# EAGLE design RaspberryMesh (EAGLE 6.3)
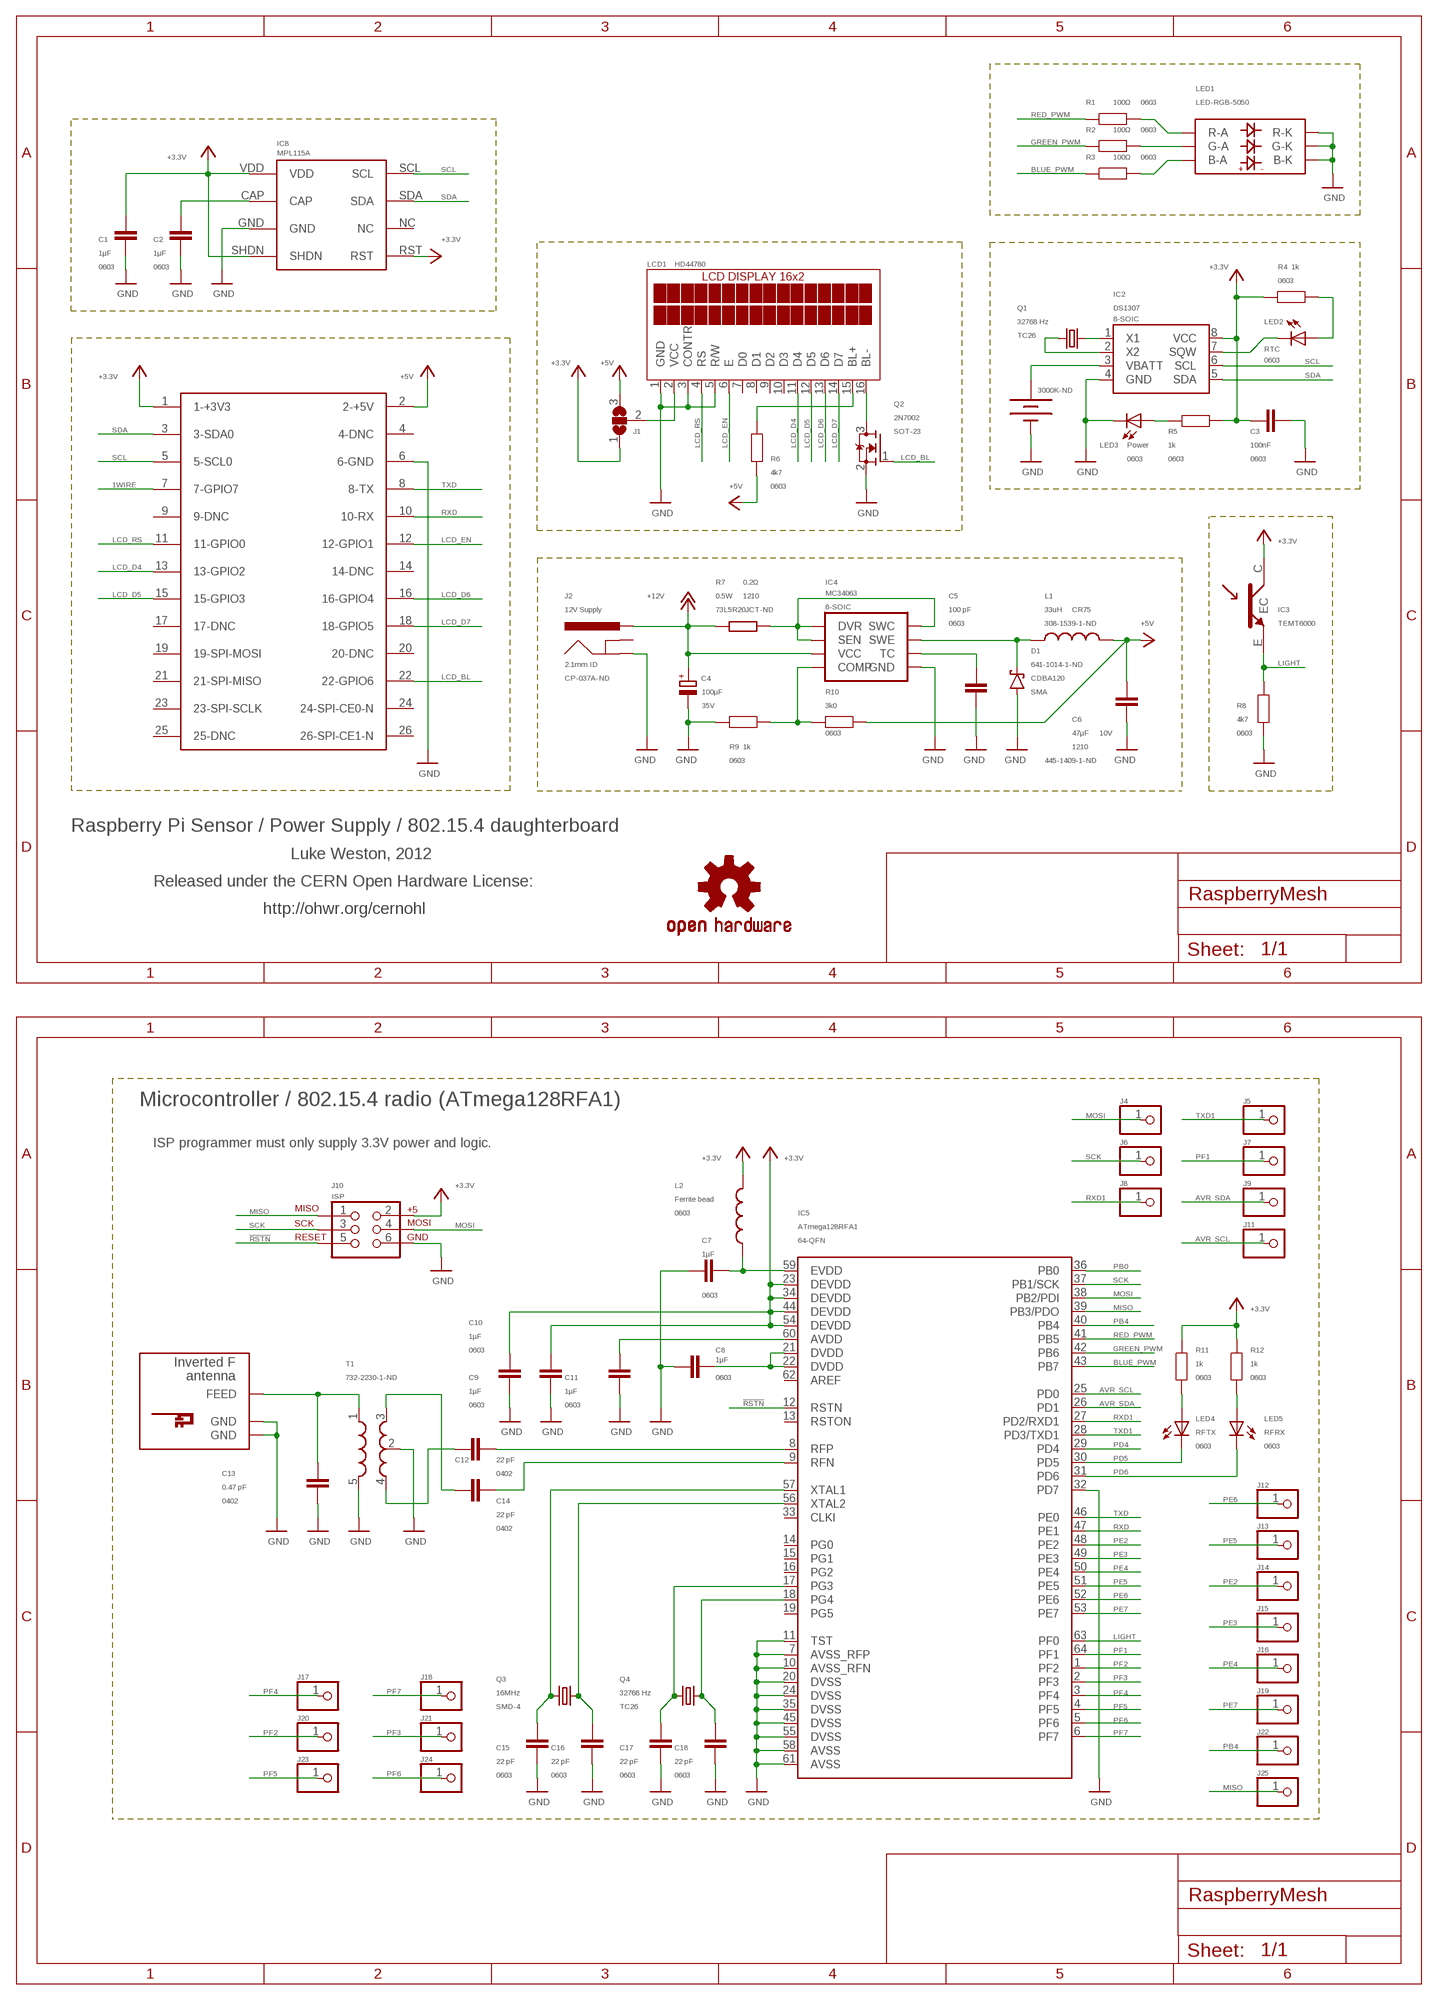
[diagram p0: schematic, sheet 1]

## Parts
A1  INVERTED_F_ANTENNA+2  [DN007+2]
B1  3000K-ND  BATTERY12MM  [BATTCON_12MM]
C1  1µF  CAP0603  [0603]
C2  1µF  CAP0603  [0603]
C3  100nF  CAP0603  [0603]
C4  100µF  CPOL-EUE2.5-6  [E2,5-6]
C5  100 pF  CAP0603  [0603]
C6  47µF  C-EUC1210  [C1210]
C7  1µF  CAP0603  [0603]
C8  1µF  CAP0603  [0603]
C9  1µF  CAP0603  [0603]
C10  1µF  CAP0603  [0603]
C11  1µF  CAP0603  [0603]
C12  22 pF  CAP0402  [C0402]
C13  0.47 pF  CAP0402  [C0402]
C14  22 pF  CAP0402  [C0402]
C15  22 pF  CAP0603  [0603]
C16  22 pF  CAP0603  [0603]
C17  22 pF  CAP0603  [0603]
C18  22 pF  CAP0603  [0603]
D1  CDBA120  SCHOTTKY  [SMA]
IC1  MPL115A  [MPL115A]
IC2  DS1307  DS1307SO8  [SO08]
IC3  TEMT6000  TEMT6000SMT  [TEMT6000]
IC4  MC34063  MC34063SMD  [SO08@1]
IC5  ATmega128RFA1  ATMEGA128RFA1  [QFN-64]
J1  SJ2W  [SJ_2]
J2  12V Supply  POWER_JACKSLT  [POWER_JACK_SLOT]
J3  RASPBERRY-PI  [RASPBERRY-PI]
J4  PINHD-1X1  [1X01]
J5  PINHD-1X1  [1X01]
J6  PINHD-1X1  [1X01]
J7  PINHD-1X1  [1X01]
J8  PINHD-1X1  [1X01]
J9  PINHD-1X1  [1X01]
J10  ISP  AVR_SPI_PRG_6NS  [2X3-NS]
J11  PINHD-1X1  [1X01]
J12  PINHD-1X1  [1X01]
J13  PINHD-1X1  [1X01]
J14  PINHD-1X1  [1X01]
J15  PINHD-1X1  [1X01]
J16  PINHD-1X1  [1X01]
J17  PINHD-1X1  [1X01]
J18  PINHD-1X1  [1X01]
J19  PINHD-1X1  [1X01]
J20  PINHD-1X1  [1X01]
J21  PINHD-1X1  [1X01]
J22  PINHD-1X1  [1X01]
J23  PINHD-1X1  [1X01]
J24  PINHD-1X1  [1X01]
J25  PINHD-1X1  [1X01]
L1  33uH  INDUCTORCR75  [CR75]
L2  Ferrite bead  INDUCTOR0603  [0603]
LCD1  HD44780  LCD_16X2_NEWLCD_16X2  [LCD_16X2_REAR]
LED1  LED-RGB-5050  LED-RGB-50505050  [LED-RGB-5050]
LED2  RTC  LED0603  [LED-0603]
LED3  Power  LED0603  [LED-0603]
LED4  RFTX  LED0603  [LED-0603]
LED5  RFRX  LED0603  [LED-0603]
Q1  32768 Hz  CRYSTAL32-SMD  [CRYSTAL-32KHZ-SMD]
Q2  2N7002  MOSFET-NREFLOW  [SOT23]
Q3  16MHz  CRYSTAL5X3  [CRYSTAL-SMD-5X3]
Q4  32768 Hz  CRYSTAL32-SMD  [CRYSTAL-32KHZ-SMD]
R1  100Ω  RESISTOR0603  [0603]
R2  100Ω  RESISTOR0603  [0603]
R3  100Ω  RESISTOR0603  [0603]
R4  1k  RESISTOR0603  [0603]
R5  1k  RESISTOR0603  [0603]
R6  4k7  RESISTOR0603  [0603]
R7  0.2Ω  R-EU_R1210  [R1210]
R8  4k7  RESISTOR0603  [0603]
R9  1k  RESISTOR0603  [0603]
R10  3k0  RESISTOR0603  [0603]
R11  1k  RESISTOR0603  [0603]
R12  1k  RESISTOR0603  [0603]
SY1  OSHW-LOGOS  [OSHW-LOGO-S]
T1  732-2230-1-ND  BALUN0805  [BALUN]

## Nets
1WIRE: J3.7(7-GPIO7)
!RSTN: IC5.12(RSTN) J10.5
+3V3: C1.2 C3.1 C9.1 C10.1 IC1.RST IC1.SHDN IC1.VDD IC2.8(VCC) IC3.C IC5.23(DEVDD) IC5.34(DEVDD) IC5.44(DEVDD) IC5.54(DEVDD) J1.1 J3.1(1-+3V3) J10.2 L2.2 R4.2 R5.2 R11.2 R12.2 ; supply symbol labelled +3.3V
+5V: C6.1 J1.3 J3.2(2-+5V) L1.P$2 R6.2 R10.1
+12V: C4.+ IC4.6(VCC) J2.PWR R7.1
AVR_SCL: IC5.25(PD0) J11.1
AVR_SDA: IC5.26(PD1) J9.1
BLUE_PWM: IC5.43(PB7) R3.2
GND: A1.GND A1.GND@1(GND) B1.GND(-) C1.1 C2.1 C3.2 C4.- C5.2 C6.2 C7.2 C8.2 C9.2 C10.2 C11.2 C13.2 C15.1 C16.1 C17.1 C18.1 D1.A IC1.GND IC2.4(GND) IC4.4(GND) IC5.7(AVSS_RFP) IC5.10(AVSS_RFN) IC5.11(TST) IC5.20(DVSS) IC5.24(DVSS) IC5.32(PD7) IC5.35(DVSS) IC5.45(DVSS) IC5.55(DVSS) IC5.58(AVSS) IC5.61(AVSS) J2.GND J3.6(6-GND) J10.6 LCD1.1(GND) LCD1.3(CONTR) LCD1.5(R/W) LED1.BK(B-K) LED1.GK(G-K) LED1.RK(R-K) LED3.C Q2.2(S) R8.1 R9.2 T1.2(GND) T1.5(GND)
GREEN_PWM: IC5.42(PB6) R2.2
LCD_BL: J3.22(22-GPIO6) Q2.1(G)
LCD_D4: J3.13(13-GPIO2) LCD1.11(D4)
LCD_D5: J3.15(15-GPIO3) LCD1.12(D5)
LCD_D6: J3.16(16-GPIO4) LCD1.13(D6)
LCD_D7: J3.18(18-GPIO5) LCD1.14(D7)
LCD_EN: J3.12(12-GPIO1) LCD1.6(E)
LCD_RS: J3.11(11-GPIO0) LCD1.4(RS)
LIGHT: IC3.E IC5.63(PF0) R8.2
MISO: IC5.39(PB3/PDO) J10.1 J25.1
MOSI: IC5.38(PB2/PDI) J4.1 J10.4
N$1: J1.2 LCD1.2(VCC)
N$2: IC4.1(SWC) IC4.7(SEN) IC4.8(DVR) R7.2
N$3: LCD1.15(BL+) R6.1
N$4: IC2.7(SQW) LED2.C
N$5: C5.1 IC4.3(TC)
N$6: LCD1.16(BL-) Q2.3(D)
N$7: IC4.5(COMP) R9.1 R10.2
N$8: LED3.A R5.1
N$10: C2.2 IC1.CAP
N$12: IC2.2(X2) Q1.X1
N$13: IC2.1(X1) Q1.X2
N$14: LED2.A R4.1
N$16: B1.PWR@1(+) IC2.3(VBATT)
N$18: C14.2 T1.3(OUT1)
N$25: C12.2 T1.4(OUT2)
N$30: C16.2 IC5.56(XTAL2) Q3.3
N$31: C15.2 IC5.57(XTAL1) Q3.1
N$32: C17.2 IC5.17(PG3) Q4.X1
N$34: C18.2 IC5.18(PG4) Q4.X2
N$35: C8.1 IC5.21(DVDD) IC5.22(DVDD)
N$36: C11.1 IC5.60(AVDD)
N$38: A1.FEED C13.1 T1.1(IN)
N$39: C7.1 IC5.59(EVDD) L2.1
N$40: C12.1 IC5.8(RFP)
N$41: C14.1 IC5.9(RFN)
N$43: LED4.A R11.1
N$44: LED5.A R12.1
N$45: D1.K IC4.2(SWE) L1.P$1
N$47: LED1.RA(R-A) R1.1
N$48: LED1.GA(G-A) R2.1
N$49: LED1.BA(B-A) R3.1
PB0: IC5.36(PB0)
PB4: IC5.40(PB4) J22.1
PD4: IC5.29(PD4)
PD5: IC5.30(PD5) LED4.C
PD6: IC5.31(PD6) LED5.C
PE2: IC5.48(PE2) J14.1
PE3: IC5.49(PE3) J15.1
PE4: IC5.50(PE4) J16.1
PE5: IC5.51(PE5) J13.1
PE6: IC5.52(PE6) J12.1
PE7: IC5.53(PE7) J19.1
PF1: IC5.64(PF1) J7.1
PF2: IC5.1(PF2) J20.1
PF3: IC5.2(PF3) J21.1
PF4: IC5.3(PF4) J17.1
PF5: IC5.4(PF5) J23.1
PF6: IC5.5(PF6) J24.1
PF7: IC5.6(PF7) J18.1
RED_PWM: IC5.41(PB5) R1.2
RXD: IC5.47(PE1) J3.10(10-RX)
RXD1: IC5.27(PD2/RXD1) J8.1
SCK: IC5.37(PB1/SCK) J6.1 J10.3
SCL: IC1.SCL IC2.6(SCL) J3.5(5-SCL0)
SDA: IC1.SDA IC2.5(SDA) J3.3(3-SDA0)
TXD: IC5.46(PE0) J3.8(8-TX)
TXD1: IC5.28(PD3/TXD1) J5.1
Unconnected: IC1.NC IC5.13(RSTON) IC5.14(PG0) IC5.15(PG1) IC5.16(PG2) IC5.19(PG5) IC5.33(CLKI) IC5.62(AREF) J2.SW(GNDBREAK) J3.4(4-DNC) J3.9(9-DNC) J3.14(14-DNC) J3.17(17-DNC) J3.19(19-SPI-MOSI) J3.20(20-DNC) J3.21(21-SPI-MISO) J3.23(23-SPI-SCLK) J3.24(24-SPI-CE0-N) J3.25(25-DNC) J3.26(26-SPI-CE1-N) LCD1.7(D0) LCD1.8(D1) LCD1.9(D2) LCD1.10(D3)

## Notes on the sheet
- Raspberry Pi Sensor / Power Supply / 802.15.4 daughterboard
- Luke Weston, 2012
- Released under the CERN Open Hardware License:
- http://ohwr.org/cernohl
- Microcontroller / 802.15.4 radio (ATmega128RFA1)
- ISP programmer must only supply 3.3V power and logic.

## Library data of the parts
A1 = antenna:INVERTED_F_ANTENNA: 2.4GHz Inverted F Antenna Based on TI Design Note DN007
B1 = SparkFun:BATTERY: Battery Holders Various common sizes : AA, AAA, 20mm coin cell and 12mm coin cell.
C1-C3 C5 C7-C11 C15-C18 = freetronics-master-v1:CAP: Capacitor Standard 0603 ceramic capacitor, and 0.1" leaded capacitor.; PACKAGE: 0603
C4 = rcl:CPOL-EU: POLARIZED CAPACITOR, European symbol; VOLTAGE: 35V
C6 = rcl:C-EU: CAPACITOR, European symbol; PACKAGE: 1210; SKU: 445-1409-1-ND; VOLTAGE: 10V
C12-C14 = freetronics-master-v1:CAP: Capacitor Standard 0603 ceramic capacitor, and 0.1" leaded capacitor.; PACKAGE: 0402
D1 = freetronics-luke:SCHOTTKY; PACKAGE: SMA; SKU: 641-1014-1-ND
IC1 = SparkFun:MPL115A; NAME2: IC8; VALUE2: MPL115A
IC2 = SparkFun:DS1307; PACKAGE: 8-SOIC
IC3 = freetronics-jon:TEMT6000
IC4 = SparkFun:MC34063; PACKAGE: 8-SOIC
IC5 = SparkFun:ATMEGA128RFA1; PACKAGE: 64-QFN
J1 = jumper:SJ2W: SMD solder JUMPER
J2 = SparkFun:POWER_JACK: Power Jack This is the standard 5.5mm barrel jack for power. The PTH is the most common, proven, reliable, footprint. All others are experimental. The Slot footprint only works if the mill layer is transmitted to the PCB fab house so be warned. Spark Fun Electronics SKU : PRT-00119. Mating wall wart : TOL-00298 (and others); DIAMETER: 2.1mm ID; SKU: CP-037A-ND
J3 = RaspberryPi:RASPBERRY-PI: Raspberry Pi Board <http://www.raspberrypi.org/> Jacques Lagnel V1.0 (beta) 2012 Board dimension: Forum 3D model <http://www.raspberrypi.org/forum/general-discussion/mechanical-profile-3d-models?value=3d%20model&type=1&include=1&search=1&ret=all> The GPIO Connector (P1): http://elinux.org/RPi_Low-level_peripherals
J4-J9 J11-J25 = pinhead:PINHD-1X1: PIN HEADER
J10 = SparkFun:AVR_SPI_PRG_6: AVR ISP 6 Pin This is the reduced ISP connector for AVR programming. Common on Arduino. This footprint will take up less PCB space and can be used with a 10-pin to 6-pin adapter such as SKU: BOB-08508
L1 = SparkFun:INDUCTOR: Inductors Basic Inductor/Choke - 0603 and 1206. Footprints are not proven and vary greatly between part numbers.; PACKAGE: CR75; SKU: 308-1539-1-ND
L2 = freetronics-master-v1:INDUCTOR: Inductors Basic Inductor/Choke - 0603 and 1206. Footprints are not proven and vary greatly between part numbers.; PACKAGE: 0603
LCD1 = freetronics-master-v1:LCD_16X2_NEW: Tuxgraphics LCD display 16x2 characters reflective, without background light Source: tuxgr_12x2_r2.pdf
LED1 = freetronics-master-v1:LED-RGB-5050
LED2-LED5 = freetronics-master-v1:LED: LEDs Standard schematic elements and footprints for 5mm, 3mm, 1206, and 0603 sized LEDs. 5mm - Spark Fun Electronics SKU : COM-00529 (and others); PACKAGE: 0603
Q1 Q4 = SparkFun:CRYSTAL: Crystals Various standard crystals. Proven footprints. Spark Fun Electronics SKU : COM-00534; PACKAGE: TC26
Q2 = adafruit:MOSFET-N: N-Channel Mosfet 2N7002E - 60V 260mA SOT23 [Digikey: 2N7002ET1GOSTR-ND] - REEL BSH103 - 30V 850mA SOT23 [Digikey: 568-5013-1-ND]; PACKAGE: SOT-23
Q3 = SparkFun:CRYSTAL: Crystals Various standard crystals. Proven footprints. Spark Fun Electronics SKU : COM-00534; PACKAGE: SMD-4
R1-R6 R8-R12 = freetronics-master-v1:RESISTOR: Resistor Basic schematic elements and footprints for 0603, 1206, and PTH 1/10th watt (small) resistors.; PACKAGE: 0603
R7 = rcl:R-EU_: RESISTOR, European symbol; PACKAGE: 1210; POWER: 0.5W; SKU: 73L5R20JCT-ND
SY1 = SparkFun:OSHW-LOGO: Open Source Hardware Logo This logo indicates the piece of hardware it is found on incorporates a OSHW license and/or adheres to the definition of open source hardware found here: http://freedomdefined.org/OSHW
T1 = SparkFun:BALUN

## Board
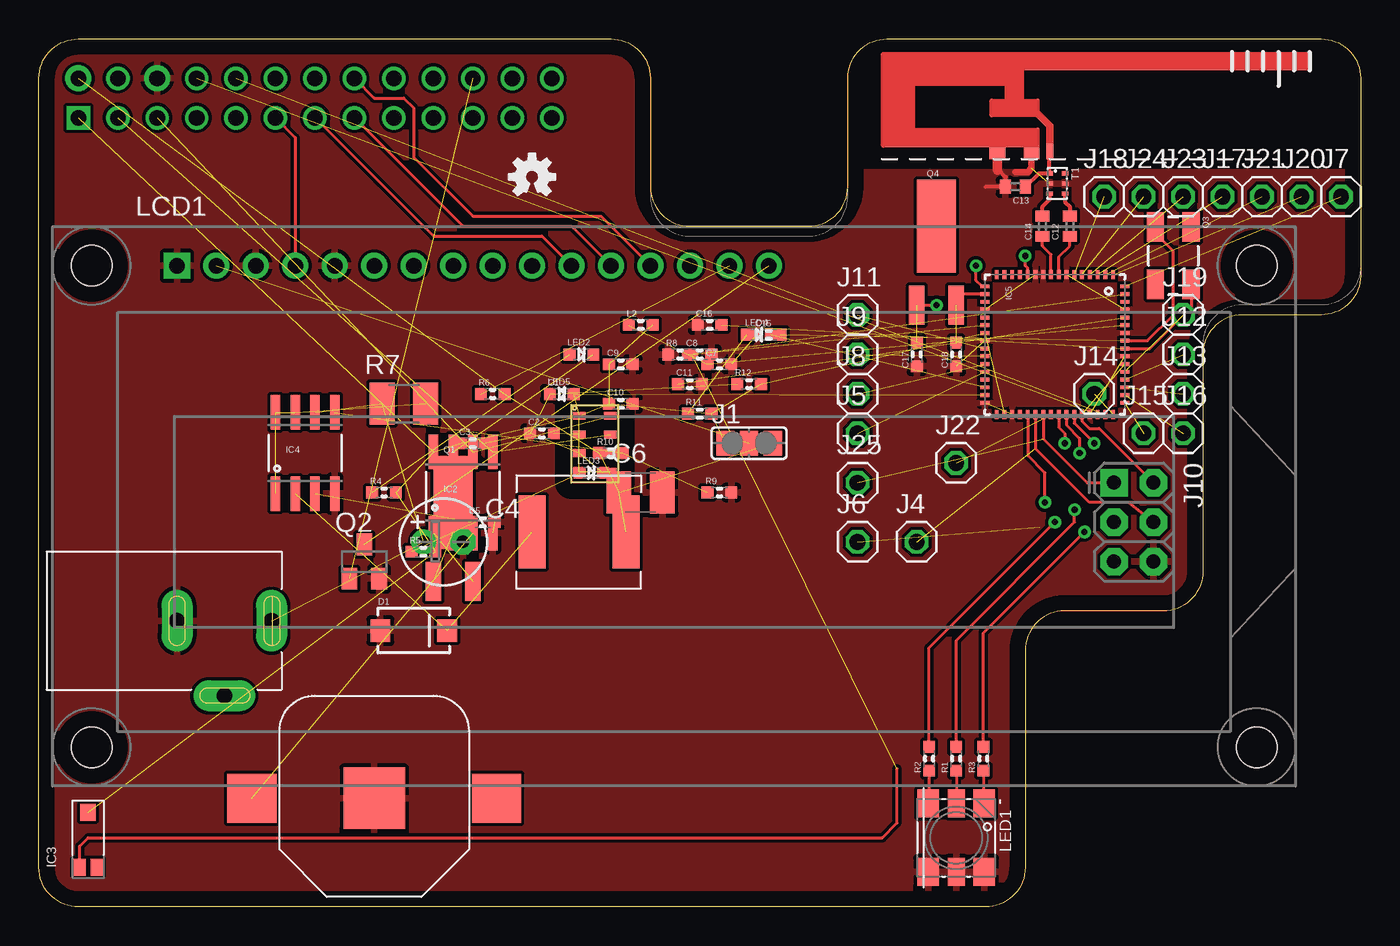
[diagram p1: board, top side]
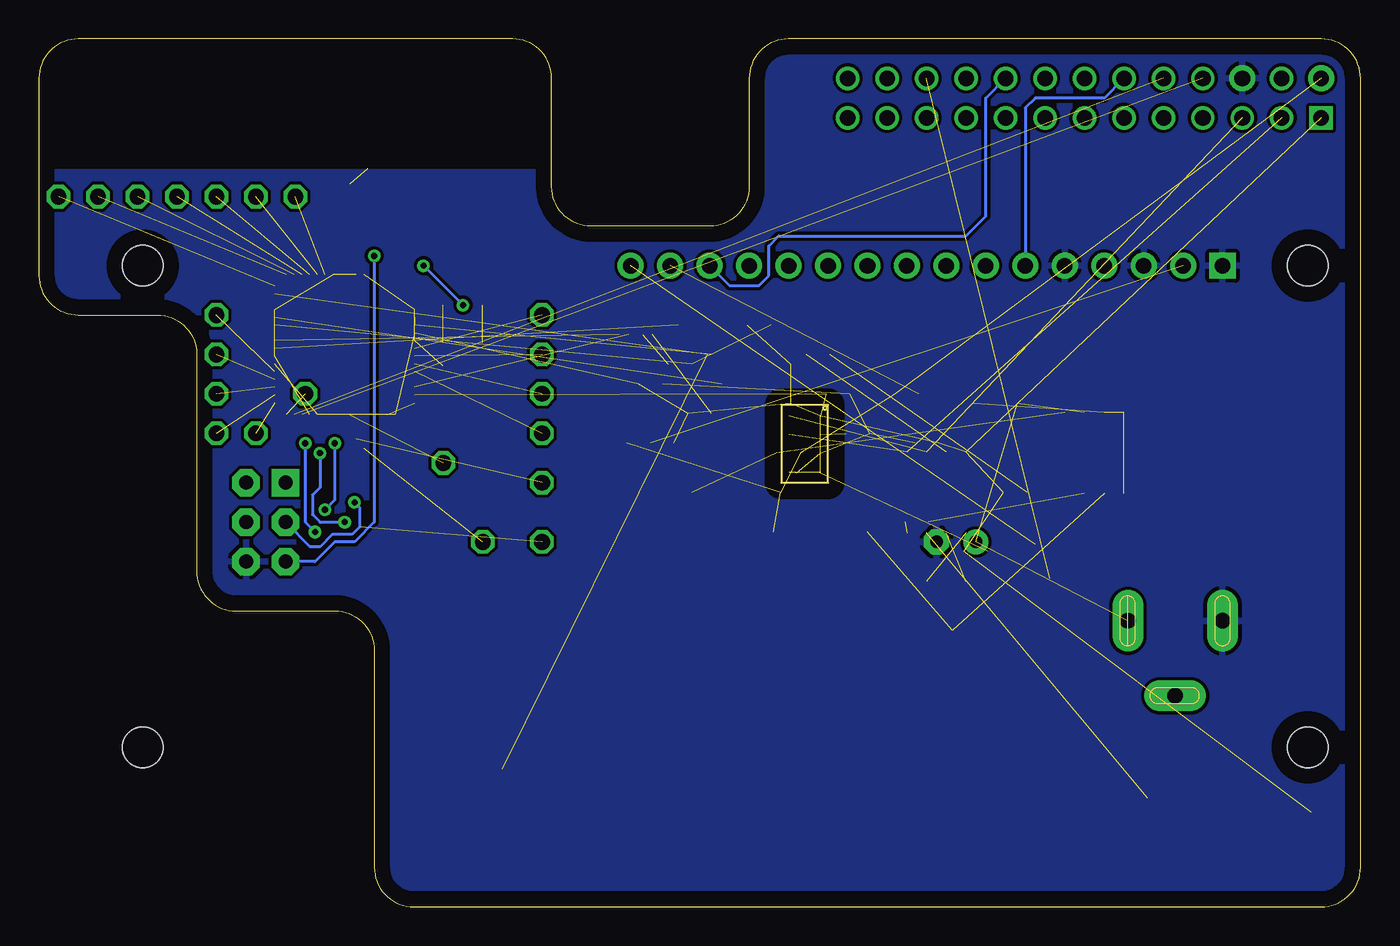
[diagram p2: board, bottom side, seen from below]

Size 85.09 x 55.88 mm. Coordinates in mm from the lower left corner, seen from the top.
Outline: 2.54,55.88 36.83,55.88 arc-90 39.37,53.34 39.37,46.35 arc90 41.91,43.81 49.53,43.81 arc90 52.07,46.35 52.07,53.34 arc-90 54.61,55.88 82.55,55.88 arc-90 85.09,53.34 85.09,40.64 arc-90 82.55,38.1 77.47,38.1 arc90 74.93,35.56 74.93,21.59 arc-90 72.39,19.05 66.04,19.05 arc90 63.5,16.51 63.5,2.54 arc-90 60.96,0 2.54,0 arc-90 0,2.54 0,53.34 arc-90 2.54,55.88
Copper layers (1*16): Top 0.035mm / dielectric 1.5mm / Bottom 0.035mm
Design rules "default": minimum track width 10mil, minimum drill 24mil, track to track 8mil, track to pad 8mil, pad to pad 8mil, via to via 8mil, smd to smd 8mil, copper to edge 40mil, drill to drill 8mil, minimum pad ring 10mil, minimum via ring 8mil, stop-mask expansion 4mil, vias tented up to drill 0mil, thermal gap 10mil
tRestrict: area 51.4,47.6 to 85.7,56.5
bRestrict: area 51.4,47.6 to 85.7,56.5

### Footprints (pad centres in the part's own frame; a part is rotated, then mirrored left to right if it is on the bottom)
DN007+2 = smd 0.46 x 1: FEED 2.22,-2.8 | smd 1.01 x 0.74: GND -1.16,-2.93; GND@1 1.035,-2.93
BATTCON_12MM = smd 3.962 x 3.962: GND 0,0 | smd 3.175 x 3.175: PWR@1 -7.874,0; PWR@2 7.874,0
0603 = smd 0.762 x 0.762: 1 -0.762,0; 2 0.762,0
E2,5-6 = drill 0.813 pad 1.6: + -1.27,0 | drill 0.813 pad 1.6 octagon: - 1.27,0
C1210 = smd 1.6 x 2.7: 1 -1.4,0; 2 1.4,0
C0402 = smd 0.7 x 0.9: 1 -0.65,0; 2 0.65,0
SMA = smd 1.27 x 1.47: A -2.15,0; K 2.15,0
MPL115A = smd 0.8 x 0.5: CAP 0.5,3.1; GND 0.5,1.9; NC 2.5,1.9; RST 2.5,0.7; SCL 2.5,4.3; SDA 2.5,3.1; SHDN 0.5,0.7; VDD 0.5,4.3
SO08 = smd 0.61 x 2.21: 1 -1.905,-2.616; 2 -0.635,-2.616; 3 0.635,-2.616; 4 1.905,-2.616; 5 1.905,2.616; 6 0.635,2.616; 7 -0.635,2.616; 8 -1.905,2.616
TEMT6000 = smd 1.1 x 1: C 2.28,0 | smd 1.1 x 0.8: E -1.27,0.55; NC -1.27,-0.55
SO08@1 = smd 0.61 x 2.21: 1 -1.905,-2.616; 2 -0.635,-2.616; 3 0.635,-2.616; 4 1.905,-2.616; 5 1.905,2.616; 6 0.635,2.616; 7 -0.635,2.616; 8 -1.905,2.616
QFN-64 = smd 0.6 x 0.25: 1 -4.5,3.75; 2 -4.5,3.25; 3 -4.5,2.75; 4 -4.5,2.25; 5 -4.5,1.75; 6 -4.5,1.25; 7 -4.5,0.75; 8 -4.5,0.25; 9 -4.5,-0.25; 10 -4.5,-0.75; 11 -4.5,-1.25; 12 -4.5,-1.75; 13 -4.5,-2.25; 14 -4.5,-2.75; 15 -4.5,-3.25; 16 -4.5,-3.75; 33 4.5,-3.75; 34 4.5,-3.25; 35 4.5,-2.75; 36 4.5,-2.25; 37 4.5,-1.75; 38 4.5,-1.25; 39 4.5,-0.75; 40 4.5,-0.25; 41 4.5,0.25; 42 4.5,0.75; 43 4.5,1.25; 44 4.5,1.75; 45 4.5,2.25; 46 4.5,2.75; 47 4.5,3.25; 48 4.5,3.75 | smd 0.25 x 0.6: 17 -3.75,-4.5; 18 -3.25,-4.5; 19 -2.75,-4.5; 20 -2.25,-4.5; 21 -1.75,-4.5; 22 -1.25,-4.5; 23 -0.75,-4.5; 24 -0.25,-4.5; 25 0.25,-4.5; 26 0.75,-4.5; 27 1.25,-4.5; 28 1.75,-4.5; 29 2.25,-4.5; 30 2.75,-4.5; 31 3.25,-4.5; 32 3.75,-4.5; 49 3.75,4.5; 50 3.25,4.5; 51 2.75,4.5; 52 2.25,4.5; 53 1.75,4.5; 54 1.25,4.5; 55 0.75,4.5; 56 0.25,4.5; 57 -0.25,4.5; 58 -0.75,4.5; 59 -1.25,4.5; 60 -1.75,4.5; 61 -2.25,4.5; 62 -2.75,4.5; 63 -3.25,4.5; 64 -3.75,4.5
SJ_2 = smd 1.168 x 1.6: 1 -1.524,0; 2 0,0; 3 1.524,0
POWER_JACK_SLOT = drill 1 pad 2 long: GND 0,0; PWR 0,6.096; SW 4.826,3.048
RASPBERRY-PI = drill 1 square: 1 2.54,50.8 | drill 1 pad 1.676: 2 2.54,53.34; 6 7.62,53.34 | drill 1: 3 5.08,50.8; 4 5.08,53.34; 5 7.62,50.8; 7 10.16,50.8; 8 10.16,53.34; 9 12.7,50.8; 10 12.7,53.34; 11 15.24,50.8; 12 15.24,53.34; 13 17.78,50.8; 14 17.78,53.34; 15 20.32,50.8; 16 20.32,53.34; 17 22.86,50.8; 18 22.86,53.34; 19 25.4,50.8; 20 25.4,53.34; 21 27.94,50.8; 22 27.94,53.34; 23 30.48,50.8; 24 30.48,53.34; 25 33.02,50.8; 26 33.02,53.34
1X01 = drill 1.016 octagon: 1 0,0
2X3-NS = drill 0.9 pad 1.778 square: 1 -2.54,-1.27 | drill 0.9 pad 1.778 octagon: 2 -2.54,1.27; 3 0,-1.27; 4 0,1.27; 5 2.54,-1.27; 6 2.54,1.27
CR75 = smd 1.75 x 4.7: P$1 0,0; P$2 6.05,0
LCD_16X2_REAR = drill 1 pad 1.676 square: 1 0,0 | drill 1 pad 1.676: 2 2.54,0; 3 5.08,0; 4 7.62,0; 5 10.16,0; 6 12.7,0; 7 15.24,0; 8 17.78,0; 9 20.32,0; 10 22.86,0; 11 25.4,0; 12 27.94,0; 13 30.48,0; 14 33.02,0; 15 35.56,0; 16 38.1,0 | hole 2.6: -5.5,-31; 69.5,-31; -5.5,0; 69.5,0
LED-RGB-5050 = smd 1.8 x 1.4: BA -2.2,1.8; BK 2.2,1.8; GA -2.2,-1.8; GK 2.2,-1.8 | smd 1.8 x 1.1: RA -2.2,0; RK 2.2,0
LED-0603 = smd 0.762 x 0.762: A -0.762,0; C 0.762,0
CRYSTAL-32KHZ-SMD = smd 2.5 x 6: SHEILD 0,5.08 | smd 1 x 2.5: X1 -1.27,0; X2 1.27,0
SOT23 = smd 1 x 1.4: 1 -0.95,-1.1; 2 0.95,-1.1; 3 0,1.1
CRYSTAL-SMD-5X3 = smd 1.9 x 1.1: 1 -1.85,-1.15; 2 1.85,-1.15; 3 1.85,1.15; 4 -1.85,1.15
R1210 = smd 1.6 x 2.7: 1 -1.4,0; 2 1.4,0
BALUN = smd 0.27 x 0.4: 1 -0.7,-0.5; 2 -0.05,-0.5; 3 0.6,-0.5; 4 0.6,0.5; 5 -0.05,0.5; 6 -0.7,0.5

### Placement (x,y rotation side)
A1  62.87,51.44 0 top
B1  21.59,6.99 0 top
C1  33.66,33.02 0 top
C2  32.38,30.48 0 top
C3  27.94,29.84 0 top
C4  26.04,23.5 0 top
C5  28.57,24.77 0 top
C6  38.73,26.67 0 top
C7  43.81,34.92 0 top
C8  42.55,35.56 0 top
C9  37.47,34.92 0 top
C10  37.47,32.38 0 top
C11  41.91,33.66 0 top
C12  66.36,43.81 90 top
C13  62.87,46.35 180 top
C14  64.61,43.81 90 top
C15  46.99,36.83 0 top
C16  43.18,37.47 0 top
C17  56.52,35.56 90 top
C18  59.05,35.56 90 top
D1  24.13,17.78 0 top
IC1  34.29,27.3 0 top
IC2  27.3,26.67 0 top
IC3  3.17,3.81 90 top
IC4  17.14,29.21 0 top
IC5  65.41,36.2 270 top
J1  45.72,29.84 0 top
J2  8.89,18.41 270 top
J3  0,0 0 top
J4  56.52,23.5 0 top
J5  52.7,30.48 0 top
J6  52.7,23.5 0 top
J7  83.82,45.72 0 top
J8  52.7,33.02 0 top
J9  52.7,35.56 0 top
J10  70.48,24.77 270 top
J11  52.7,38.1 0 top
J12  73.66,35.56 0 top
J13  73.66,33.02 0 top
J14  67.94,33.02 0 top
J15  71.12,30.48 0 top
J16  73.66,30.48 0 top
J17  76.2,45.72 0 top
J18  68.58,45.72 0 top
J19  73.66,38.1 0 top
J20  81.28,45.72 0 top
J21  78.74,45.72 0 top
J22  59.05,28.57 0 top
J23  73.66,45.72 0 top
J24  71.12,45.72 0 top
J25  52.7,27.3 0 top
L1  31.75,24.13 0 top
L2  38.73,37.47 0 top
LCD1  8.89,41.27 0 top
LED1  59.05,4.45 270 top
LED2  34.92,35.56 0 top
LED3  35.56,27.94 0 top
LED4  46.35,36.83 0 top
LED5  33.66,33.02 0 top
Q1  26.67,20.95 0 top
Q2  20.95,22.23 0 top
Q3  73.03,41.91 270 top
Q4  57.78,38.73 0 top
R1  59.05,9.53 90 top
R2  57.31,9.53 90 top
R3  60.8,9.53 90 top
R4  22.23,26.67 0 top
R5  24.77,22.86 0 top
R6  29.21,33.02 0 top
R7  23.5,32.38 0 top
R8  41.27,35.56 0 top
R9  43.81,26.67 0 top
R10  36.83,29.21 0 top
R11  42.55,31.75 0 top
R12  45.72,33.66 0 top
SY1  31.75,46.99 0 top
T1  65.56,46.51 270 top

### Tracks (layer width: path | path; a pad name or v marks a point on that pad's centre or on a via)
!RSTN  (via drill 0.4)
  Top 0.203: IC5.12 63.66,41.12 63.5,41.27 v63.5,41.91
  Bottom 0.203: v63.5,41.91 63.5,24.77 64.77,23.5 66.04,23.5 67.31,22.23 J10.5
+3V3  (19 unrouted)
  Top 0.203: IC5.44 67.16,31.27 67.63,30.8 68.26,30.8 J10.2
+5V  (5 unrouted)
+12V  (3 unrouted)
AVR_SCL  (1 unrouted)
AVR_SDA  (1 unrouted)
BLUE_PWM  (via drill 0.4)
  Top 0.203: R3.2 60.8,17.62 v67.31,24.13 | IC5.43 66.66,31.14 v67.94,29.84
  Bottom 0.203: v67.94,29.84 67.94,24.77 v67.31,24.13
GND  (16 unrouted)
  Top 0.254: 60.96,46.35 C13.2 62.23,46.37 62.23,46.99 61.8,47.42 61.7,47.42
  Top 0.406: A1.GND@1 63.9,47.55 63.66,47.31 62.87,47.31
  Top 0.61: A1.GND 61.7,47.42
  pour Top: -0.64,56.52 85.72,56.52 85.72,-0.64 -0.64,-0.64
  pour Bottom: -0.64,56.52 85.72,56.52 85.72,-0.64 -0.64,-0.64
GREEN_PWM  (via drill 0.4)
  Top 0.203: R2.2 57.31,16.67 v65.41,24.77 | IC5.42 66.16,31 66.99,30.16 v66.99,29.21
  Bottom 0.203: v66.99,29.21 66.99,26.99 67.47,26.51 67.47,25.24 66.99,24.77 v65.41,24.77
LCD_BL  (1 unrouted)
LCD_D4
  Top 0.203: LCD1.11 32.38,43.18 25.4,43.18 J3.13
LCD_D5
  Top 0.203: LCD1.12 34.29,43.81 27.3,43.81 J3.15
LCD_D6
  Top 0.203: J3.16 21.59,52.07 23.5,52.07 24.13,51.44 24.13,48.26 27.94,44.45 28.57,44.45 36.2,44.45 LCD1.13
LCD_D7
  Bottom 0.203: J3.18 24.13,52.07 24.13,44.45 25.4,43.18 37.47,43.18 38.1,42.55 38.1,40.64 38.73,40.01 40.64,40.01 LCD1.14
LCD_EN
  Bottom 0.203: J3.12 16.51,52.07 20.95,52.07 21.59,51.44 LCD1.6
LCD_RS
  Top 0.203: J3.11 16.51,49.53 LCD1.4
LIGHT  (2 unrouted)
  Top 0.203: IC3.E 2.62,3.9 3.17,4.45 54.29,4.45 55.24,5.4 55.24,8.89
MISO  (1 unrouted)
  Top 0.203: IC5.39 64.66,30.12 67.47,27.3 J10.1
MOSI  (1 unrouted)
  Top 0.203: J10.4 70.17,26.04 67.63,26.04 64.16,29.51 IC5.38
N$1  (1 unrouted)
N$2  (3 unrouted)
N$3  (1 unrouted)
N$4  (1 unrouted)
N$5  (1 unrouted)
N$6  (1 unrouted)
N$7  (2 unrouted)
N$8  (1 unrouted)
N$10  (1 unrouted)
N$12  (1 unrouted)
N$13  (1 unrouted)
N$14  (1 unrouted)
N$16  (1 unrouted)
N$18
  Top 0.254: T1.3 65.06,45.54 64.61,45.09 C14.2
N$25
  Top 0.254: T1.4 66.06,45.38 66.36,45.09 C12.2
N$30  (1 unrouted)
  Top 0.203: IC5.56 71.5,35.95 74.17,38.62 Q3.3
N$31  (1 unrouted)
  Top 0.203: IC5.57 71.37,36.45 73.03,38.1 73.03,42.23 72.07,43.18 72.07,43.56 Q3.1
N$32  (via drill 0.4)  (1 unrouted)
  Top 0.203: Q4.X1 v57.78,38.73 | IC5.17 60.7,39.95 60.33,40.32 v60.33,41.27
  Bottom 0.203: v57.78,38.73 v60.33,41.27
N$34  (1 unrouted)
  Top 0.203: IC5.18 59.13,39.45 59.05,39.37 Q4.X2
N$35  (2 unrouted)
N$36  (1 unrouted)
N$38
  Top 0.254: A1.FEED 65.06,48.61 T1.1 64.37,47.21 C13.1
N$39  (2 unrouted)
N$40
  Top 0.203: IC5.8 65.66,41.84 66.36,42.55 C12.1
N$41
  Top 0.203: IC5.9 65.16,42 64.61,42.55 C14.1
N$43  (1 unrouted)
N$44  (1 unrouted)
N$45  (2 unrouted)
N$47
  Top 0.203: R1.1 LED1.RA
N$48
  Top 0.203: R2.1 57.31,6.7 LED1.GA
N$49
  Top 0.203: R3.1 60.8,6.7 LED1.BA
PB4  (1 unrouted)
PD5  (1 unrouted)
PD6  (1 unrouted)
PE2  (1 unrouted)
PE3  (1 unrouted)
PE4  (1 unrouted)
PE5  (1 unrouted)
PE6  (1 unrouted)
PE7  (1 unrouted)
PF1  (1 unrouted)
PF2  (1 unrouted)
PF3  (1 unrouted)
PF4  (1 unrouted)
PF5  (1 unrouted)
PF6  (1 unrouted)
PF7  (1 unrouted)
RED_PWM  (via drill 0.4)
  Top 0.203: R1.2 59.05,17.14 66.67,24.77 v66.67,25.56 | IC5.41 65.66,30.86 66.04,30.48 v66.04,29.84
  Bottom 0.203: v66.04,29.84 66.04,26.19 v66.67,25.56
RXD  (1 unrouted)
RXD1  (1 unrouted)
SCK  (via drill 0.4)  (1 unrouted)
  Top 0.203: IC5.37 63.66,29.05 64.77,27.94 v64.77,26.04
  Bottom 0.203: J10.3 67.63,23.18 66.99,23.18 66.2,23.97 64.93,23.97 64.45,24.45 64.45,25.72 v64.77,26.04
SCL  (2 unrouted)
SDA  (2 unrouted)
TXD  (1 unrouted)
TXD1  (1 unrouted)